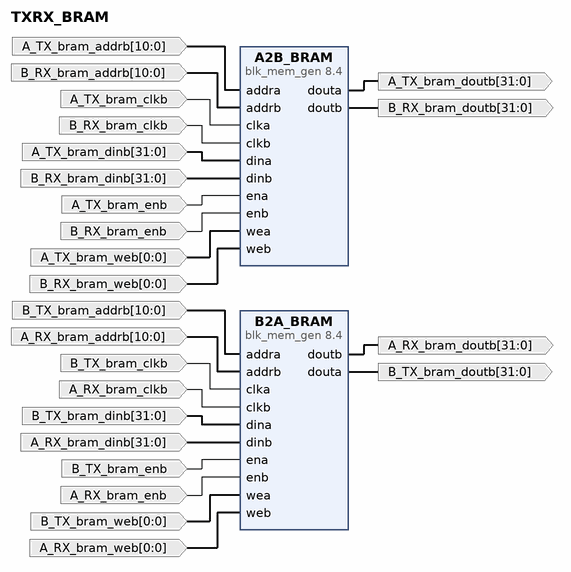
[diagram p0: block diagram of the top level]
# Vivado block design TXRX_BRAM, xcku5p-ffvb676-2-e, Vivado 2022.1
create_bd_design TXRX_BRAM

create_bd_port -dir I -from 10 -to 0 B_TX_bram_addrb
create_bd_port -dir I -type clk B_TX_bram_clkb
create_bd_port -dir I -from 31 -to 0 B_TX_bram_dinb
create_bd_port -dir O -from 31 -to 0 B_TX_bram_doutb
create_bd_port -dir I B_TX_bram_enb
create_bd_port -dir I -from 0 -to 0 B_TX_bram_web
create_bd_port -dir I A_RX_bram_enb
create_bd_port -dir I -from 10 -to 0 A_RX_bram_addrb
create_bd_port -dir I -type clk A_RX_bram_clkb
create_bd_port -dir I -from 31 -to 0 A_RX_bram_dinb
create_bd_port -dir O -from 31 -to 0 A_RX_bram_doutb
create_bd_port -dir I -from 0 -to 0 A_RX_bram_web
create_bd_port -dir I A_TX_bram_enb
create_bd_port -dir I -type clk A_TX_bram_clkb
create_bd_port -dir I -from 31 -to 0 A_TX_bram_dinb
create_bd_port -dir I -from 0 -to 0 A_TX_bram_web
create_bd_port -dir O -from 31 -to 0 A_TX_bram_doutb
create_bd_port -dir I -from 10 -to 0 A_TX_bram_addrb
create_bd_port -dir I B_RX_bram_enb
create_bd_port -dir I -from 31 -to 0 B_RX_bram_dinb
create_bd_port -dir O -from 31 -to 0 B_RX_bram_doutb
create_bd_port -dir I -from 10 -to 0 B_RX_bram_addrb
create_bd_port -dir I -type clk B_RX_bram_clkb
create_bd_port -dir I -from 0 -to 0 B_RX_bram_web

create_bd_cell -type ip -vlnv xilinx.com:ip:blk_mem_gen:8.4 B2A_BRAM
set_property -dict [list \
  CONFIG.Enable_32bit_Address false \
  CONFIG.Enable_B Use_ENB_Pin \
  CONFIG.Memory_Type True_Dual_Port_RAM \
  CONFIG.Port_B_Clock 100 \
  CONFIG.Port_B_Enable_Rate 100 \
  CONFIG.Port_B_Write_Rate 50 \
  CONFIG.Register_PortA_Output_of_Memory_Primitives true \
  CONFIG.Register_PortB_Output_of_Memory_Primitives true \
  CONFIG.Use_Byte_Write_Enable false \
  CONFIG.Use_RSTA_Pin false \
  CONFIG.Write_Depth_A 2048 \
  CONFIG.use_bram_block Stand_Alone \
] [get_bd_cells B2A_BRAM]
create_bd_cell -type ip -vlnv xilinx.com:ip:blk_mem_gen:8.4 A2B_BRAM
set_property -dict [list \
  CONFIG.Enable_32bit_Address false \
  CONFIG.Enable_B Use_ENB_Pin \
  CONFIG.Memory_Type True_Dual_Port_RAM \
  CONFIG.Port_B_Clock 100 \
  CONFIG.Port_B_Enable_Rate 100 \
  CONFIG.Port_B_Write_Rate 50 \
  CONFIG.Register_PortA_Output_of_Memory_Primitives true \
  CONFIG.Register_PortB_Output_of_Memory_Primitives true \
  CONFIG.Use_Byte_Write_Enable false \
  CONFIG.Use_RSTA_Pin false \
  CONFIG.Use_RSTB_Pin false \
  CONFIG.Write_Depth_A 2048 \
  CONFIG.use_bram_block Stand_Alone \
] [get_bd_cells A2B_BRAM]

# ---- connections ----

connect_bd_net [get_bd_pins A2B_BRAM/douta] [get_bd_ports A_TX_bram_doutb]
connect_bd_net [get_bd_pins A2B_BRAM/doutb] [get_bd_ports B_RX_bram_doutb]
connect_bd_net [get_bd_pins B2A_BRAM/douta] [get_bd_ports B_TX_bram_doutb]
connect_bd_net [get_bd_pins B2A_BRAM/doutb] [get_bd_ports A_RX_bram_doutb]
connect_bd_net -net addra_0_1 [get_bd_ports B_TX_bram_addrb] [get_bd_pins B2A_BRAM/addra]
connect_bd_net -net addra_0_2 [get_bd_ports A_TX_bram_addrb] [get_bd_pins A2B_BRAM/addra]
connect_bd_net -net addrb_0_1 [get_bd_ports A_RX_bram_addrb] [get_bd_pins B2A_BRAM/addrb]
connect_bd_net -net addrb_0_2 [get_bd_ports B_RX_bram_addrb] [get_bd_pins A2B_BRAM/addrb]
connect_bd_net -net clka_0_1 [get_bd_ports B_TX_bram_clkb] [get_bd_pins B2A_BRAM/clka]
connect_bd_net -net clka_0_2 [get_bd_ports A_TX_bram_clkb] [get_bd_pins A2B_BRAM/clka]
connect_bd_net -net clkb_0_1 [get_bd_ports A_RX_bram_clkb] [get_bd_pins B2A_BRAM/clkb]
connect_bd_net -net clkb_0_2 [get_bd_ports B_RX_bram_clkb] [get_bd_pins A2B_BRAM/clkb]
connect_bd_net -net dina_0_1 [get_bd_ports B_TX_bram_dinb] [get_bd_pins B2A_BRAM/dina]
connect_bd_net -net dina_0_2 [get_bd_ports A_TX_bram_dinb] [get_bd_pins A2B_BRAM/dina]
connect_bd_net -net dinb_0_1 [get_bd_ports A_RX_bram_dinb] [get_bd_pins B2A_BRAM/dinb]
connect_bd_net -net dinb_0_2 [get_bd_ports B_RX_bram_dinb] [get_bd_pins A2B_BRAM/dinb]
connect_bd_net -net ena_0_1 [get_bd_ports B_TX_bram_enb] [get_bd_pins B2A_BRAM/ena]
connect_bd_net -net ena_0_2 [get_bd_ports A_TX_bram_enb] [get_bd_pins A2B_BRAM/ena]
connect_bd_net -net enb_0_1 [get_bd_ports A_RX_bram_enb] [get_bd_pins B2A_BRAM/enb]
connect_bd_net -net enb_0_2 [get_bd_ports B_RX_bram_enb] [get_bd_pins A2B_BRAM/enb]
connect_bd_net -net wea_0_1 [get_bd_ports B_TX_bram_web] [get_bd_pins B2A_BRAM/wea]
connect_bd_net -net wea_0_2 [get_bd_ports A_TX_bram_web] [get_bd_pins A2B_BRAM/wea]
connect_bd_net -net web_0_1 [get_bd_ports A_RX_bram_web] [get_bd_pins B2A_BRAM/web]
connect_bd_net -net web_0_2 [get_bd_ports B_RX_bram_web] [get_bd_pins A2B_BRAM/web]

validate_bd_design
save_bd_design
